# EAGLE design LCD board (EAGLE 6.6.0)
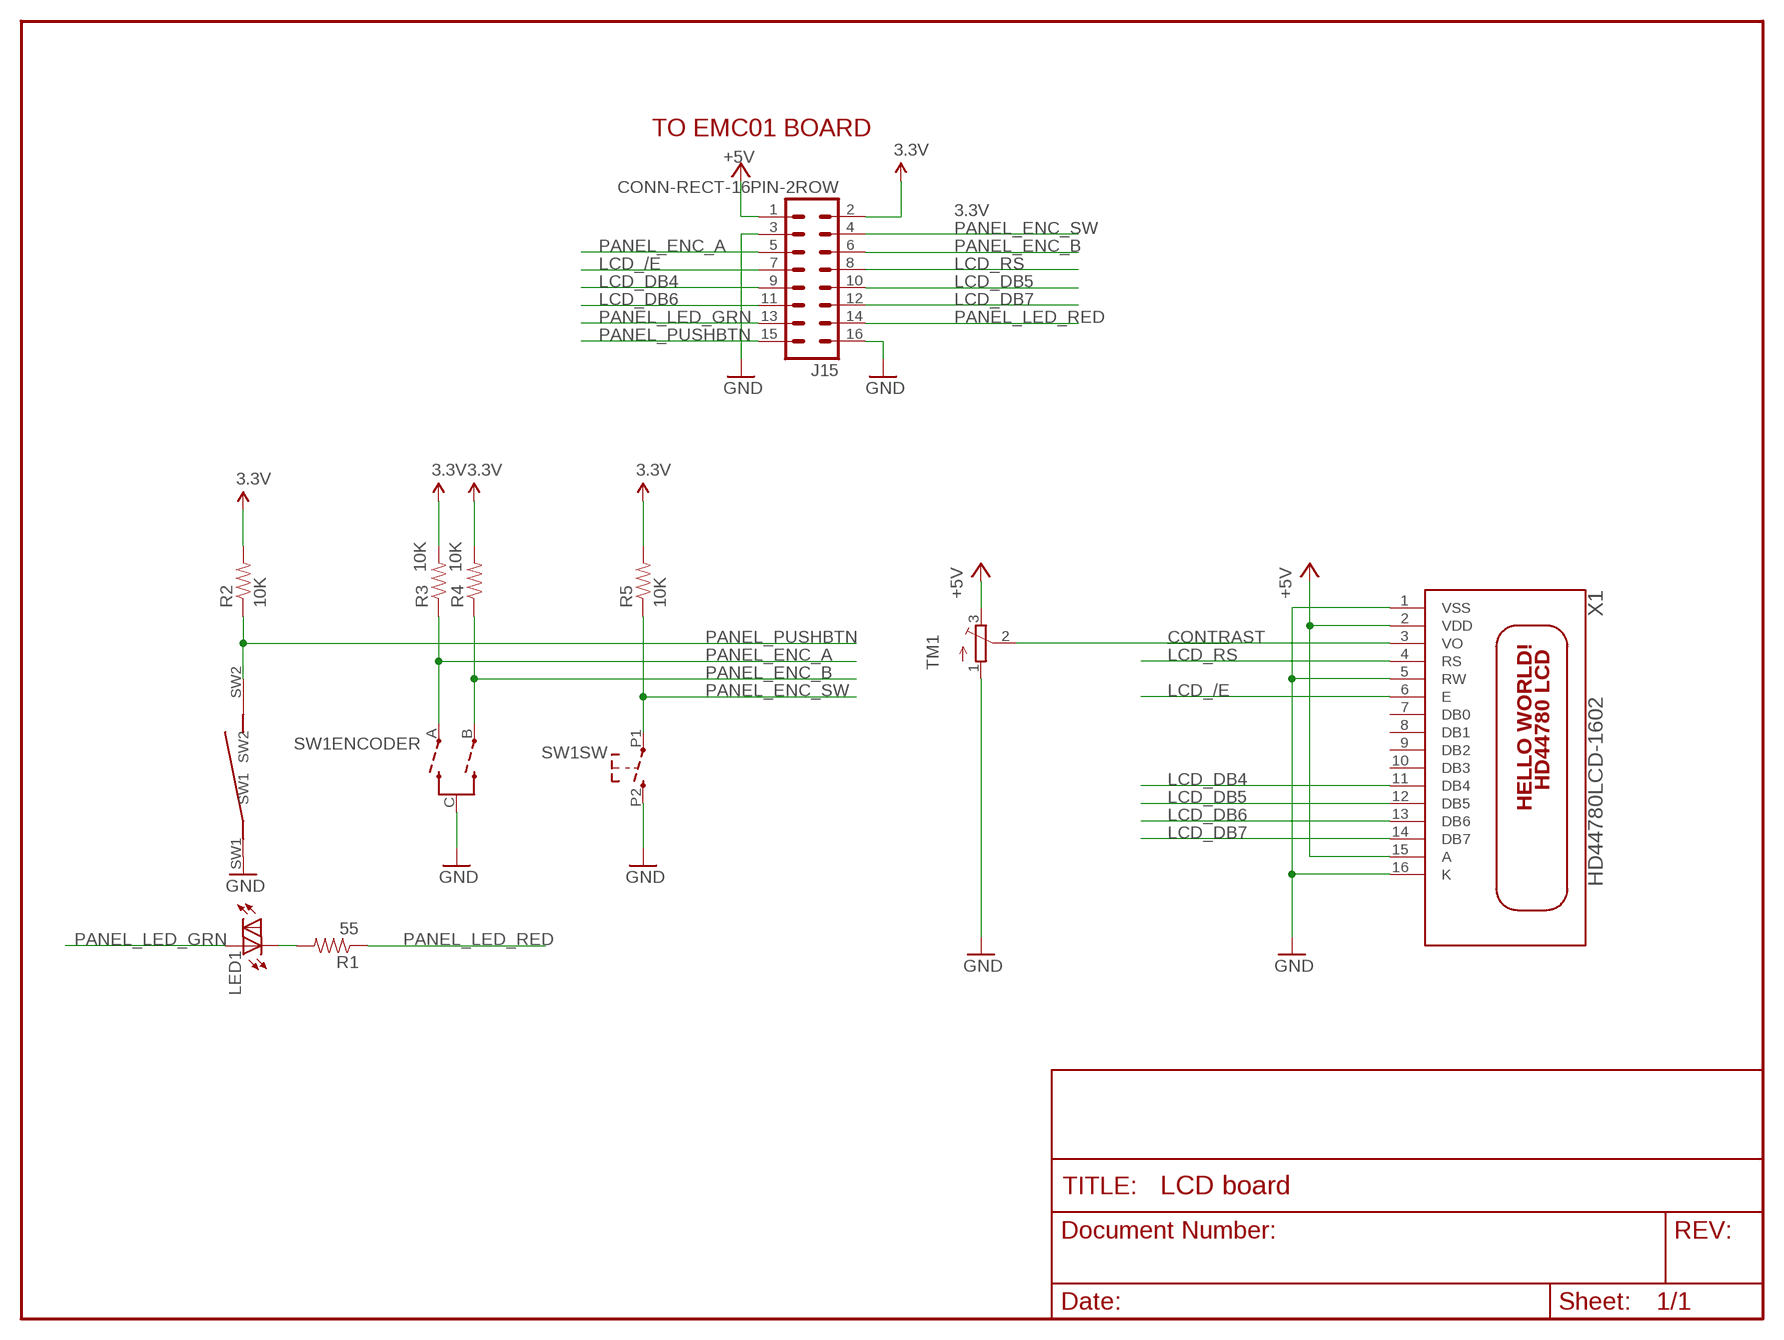
[diagram p0: schematic, sheet 1]

## Parts
J15  CONN-RECT-16PIN-2ROW  [CONN-RECT-2.54MM-16PIN-2ROW-SMTH]
LED1  LED-BUTTON  [ELAST_PAD_SQUARE_10MM_5.4MM_4X4GRID]
R1  55  RESISTOR0805-RES  [0805]
R2  10K  RESISTOR0805-RES  [0805]
R3  10K  RESISTOR0805-RES  [0805]
R4  10K  RESISTOR0805-RES  [0805]
R5  10K  RESISTOR0805-RES  [0805]
SW1  ENCODER_SW1-PEC12  [PEC12_INCREMENTAL_ENCODER]
TM1  TRIMPOTTC33X  [TC33X]
X1  HD44780LCD-1602  [LCD1602]

## Nets
3.3V: J15.2 R2.2 R3.2 R4.2 R5.2
+5V: J15.1 TM1.3(E) X1.2(VDD) X1.15(A)
GND: J15.3 J15.16 LED1.SW1 SW1.C(ENCODER:C) SW1.P2 TM1.1(A) X1.1(VSS) X1.5(RW) X1.16(K)
LCD_/E: J15.7 X1.6(E)
LCD_DB4: J15.9 X1.11(DB4)
LCD_DB5: J15.10 X1.12(DB5)
LCD_DB6: J15.11 X1.13(DB6)
LCD_DB7: J15.12 X1.14(DB7)
LCD_RS: J15.8 X1.4(RS)
N$1: TM1.2(S) X1.3(VO)
N$2: LED1.K(C) R1.2
PANEL_ENC_A: J15.5 R3.1 SW1.A(ENCODER:A)
PANEL_ENC_B: J15.6 R4.1 SW1.B(ENCODER:B)
PANEL_ENC_SW: J15.4 R5.1 SW1.P1
PANEL_LED_GRN: J15.13 LED1.A1(A)
PANEL_LED_RED: J15.14 R1.1
PANEL_PUSHBTN: J15.15 LED1.SW2 R2.1
Unconnected: X1.7(DB0) X1.8(DB1) X1.9(DB2) X1.10(DB3)

## Notes on the sheet
- TO EMC01 BOARD

## Library data of the parts
J15 = FirePick:CONN-RECT-16PIN-2ROW
LED1 = Adafruit Trellis:LED-BUTTON
R1-R5 = SparkFun-Passives:RESISTOR: Resistor Basic schematic elements and footprints for 0603, 1206, and PTH resistors.
SW1 = dp_devices:ENCODER_SW1: Incremental Encoder with push switch
TM1 = adafruit:TRIMPOT: SMT trimmer potentiometer part number TC33X http://www.ladyada.net/library/eagle
X1 = adafruit:HD44780LCD: HD44780 LCD Standard character type LCDs, available in sizes from 8x1 to 40x4!

## Board
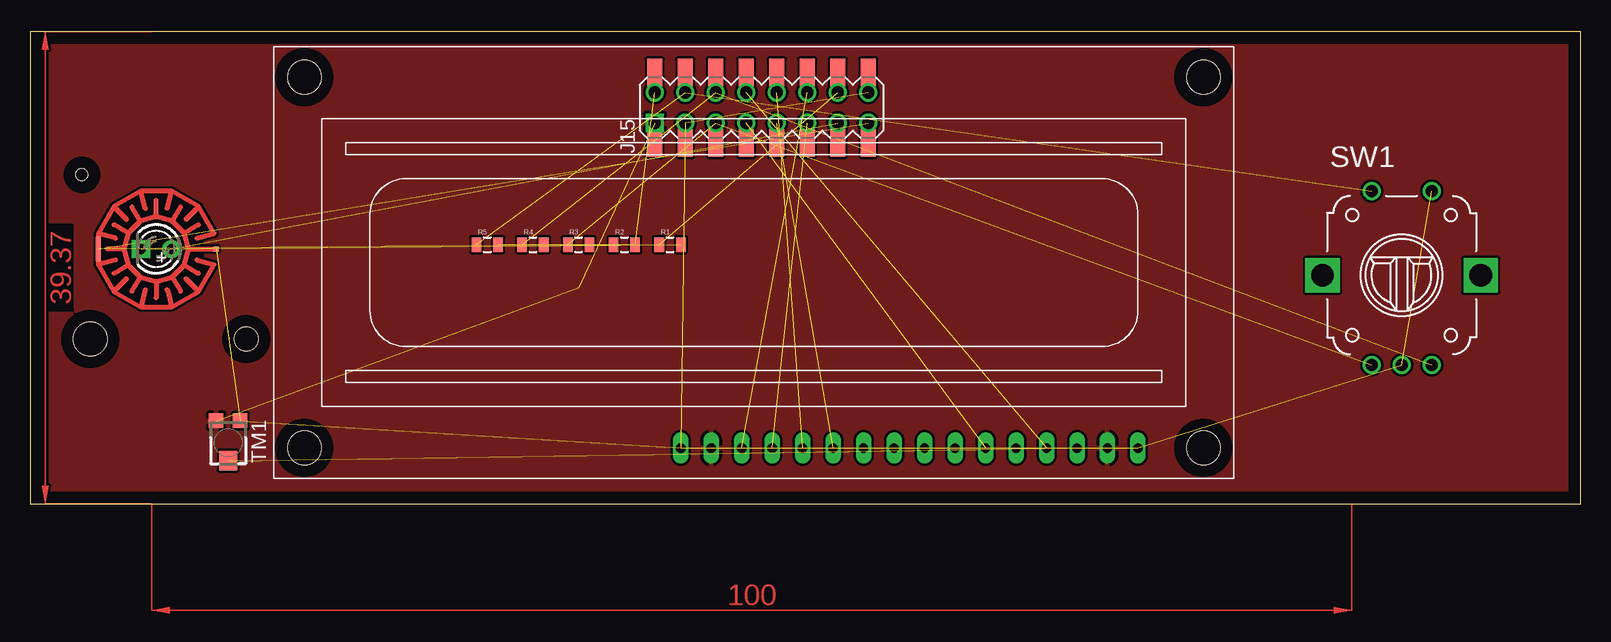
[diagram p1: board, top side]
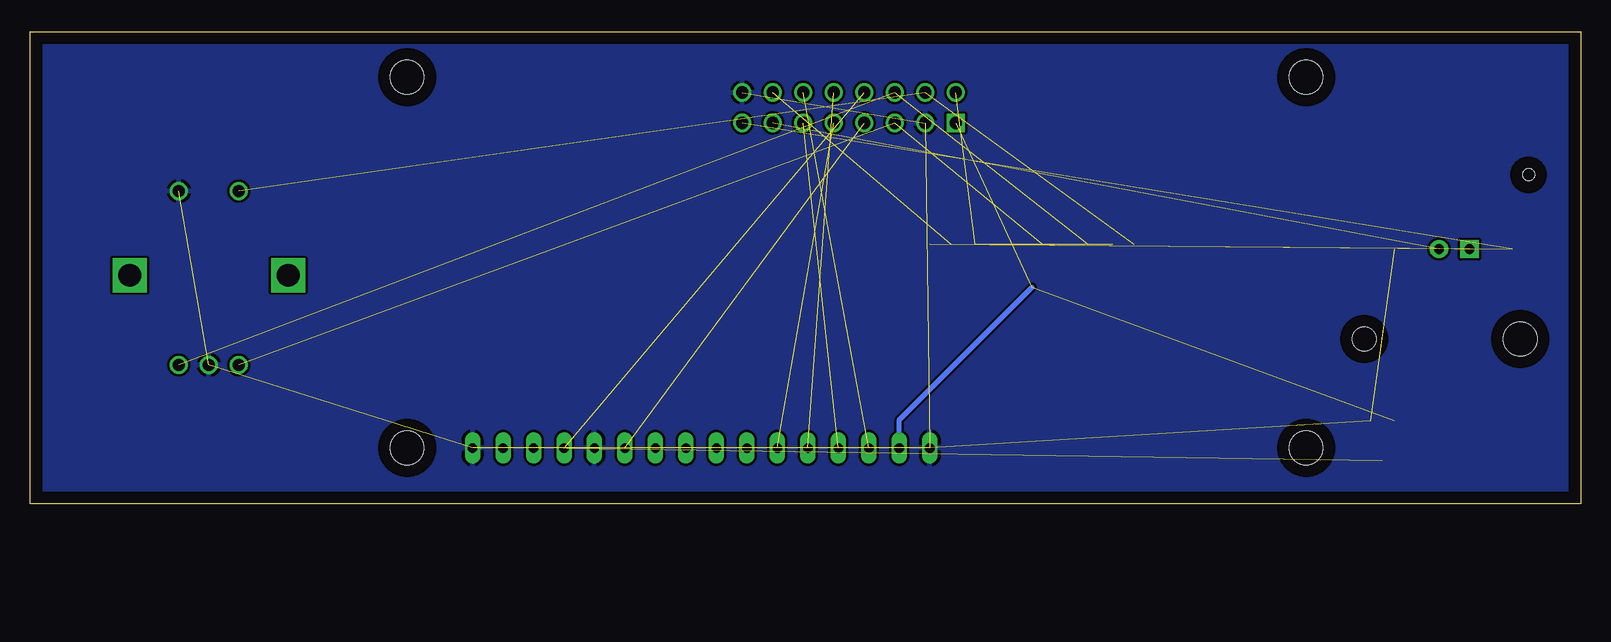
[diagram p2: board, bottom side, seen from below]

Size 129.21 x 39.36 mm. Coordinates in mm from the lower left corner, seen from the top.
Outline: 0,0 129.21,0 129.21,39.36 0,39.36 0,0
Copper layers (1*16): Top 0.035mm / dielectric 1.5mm / Bottom 0.035mm
Design rules "default": minimum track width 10mil, minimum drill 24mil, track to track 8mil, track to pad 8mil, pad to pad 8mil, via to via 8mil, smd to smd 8mil, copper to edge 40mil, drill to drill 8mil, minimum pad ring 10mil, minimum via ring 8mil, stop-mask expansion 4mil, vias tented up to drill 0mil, thermal gap 10mil

### Footprints (pad centres in the part's own frame; a part is rotated, then mirrored left to right if it is on the bottom)
CONN-RECT-2.54MM-16PIN-2ROW-SMTH = drill 1.016 square: 1 -8.89,-1.27 | drill 1.016: 2 -8.89,1.27; 3 -6.35,-1.27; 4 -6.35,1.27; 5 -3.81,-1.27; 6 -3.81,1.27; 7 -1.27,-1.27; 8 -1.27,1.27; 9 1.27,-1.27; 10 1.27,1.27; 11 3.81,-1.27; 12 3.81,1.27; 13 6.35,-1.27; 14 6.35,1.27; 15 8.89,-1.27; 16 8.89,1.27 | smd 1.27 x 2.3: P1 -8.89,-2.93; P2 -8.89,2.93; P3 -6.35,-2.93; P4 -6.35,2.93; P5 -3.81,-2.93; P6 -3.81,2.93; P7 -1.27,-2.93; P8 -1.27,2.93; P9 1.27,-2.93; P10 1.27,2.93; P11 3.81,-2.93; P12 3.81,2.93; P13 6.35,-2.93; P14 6.35,2.93; P15 8.89,-2.93; P16 8.89,2.93
ELAST_PAD_SQUARE_10MM_5.4MM_4X4GRID = drill 0.813 pad 1.524: A1 -5.99,7.26 | drill 0.813 pad 1.524 square: K -8.53,7.26 | smd 0.4 x 0.4: SW1 -2.26,7.26 | smd 0.4 x 2: SW2 -12.09,7.25 | hole 2.8: -12.76,-0.24 | hole 1: -13.46,13.46 | hole 2: 0.24,-0.24
0805 = smd 0.8 x 1.2: 1 -0.9,0; 2 0.9,0
PEC12_INCREMENTAL_ENCODER = drill 1: A -2.5,-7.5; B 2.5,-7.5; C 0,-7.5; P1 -2.5,7; P2 2.5,7 | drill 1.9 square: GND@1 -6.6,0; GND@2 6.6,0
TC33X = smd 1.2 x 1.2: 1 -1,-1.825; 3 1,-1.825 | smd 1.5 x 1.6: 2 0,1.5
LCD1602 = drill 0.8 long: 1 8,33.46; 2 10.54,33.46; 3 13.08,33.46; 4 15.62,33.46; 5 18.16,33.46; 6 20.7,33.46; 7 23.24,33.46; 8 25.78,33.46; 9 28.32,33.46; 10 30.86,33.46; 11 33.4,33.46; 12 35.94,33.46; 13 38.48,33.46; 14 41.02,33.46; 15 43.56,33.46; 16 46.1,33.46 | hole 2.8: 2.54,2.54; 2.54,33.46; 77.46,33.46; 77.46,2.54

### Placement (x,y rotation side)
J15  60.96,33.02 0 top
LED1  17.78,13.97 0 top
R1  53.34,21.59 0 top
R2  49.53,21.59 0 top
R3  45.72,21.59 0 top
R4  41.91,21.59 0 top
R5  38.1,21.59 0 top
SW1  114.3,19.05 0 top
TM1  16.51,5.08 180 top
X1  100.33,38.1 180 top

### Tracks (layer width: path | path; a pad name or v marks a point on that pad's centre or on a via)
3.3V  (4 unrouted)
+5V  (3 unrouted)
  Bottom 0.406: X1.15 56.77,6.98 45.72,18.03
  pour Top: 0,39.37 0,0 129.54,0 129.54,39.37
GND  (8 unrouted)
  pour Bottom: 0,39.37 0,0 129.54,0 129.54,39.37
LCD_/E  (1 unrouted)
LCD_DB4  (1 unrouted)
LCD_DB5  (1 unrouted)
LCD_DB6  (1 unrouted)
LCD_DB7  (1 unrouted)
LCD_RS  (1 unrouted)
N$1  (1 unrouted)
N$2  (1 unrouted)
PANEL_ENC_A  (2 unrouted)
PANEL_ENC_B  (2 unrouted)
PANEL_ENC_SW  (2 unrouted)
PANEL_LED_GRN  (1 unrouted)
PANEL_LED_RED  (1 unrouted)
PANEL_PUSHBTN  (2 unrouted)
(copper drawn outside any net)
  shapes: Top area x2